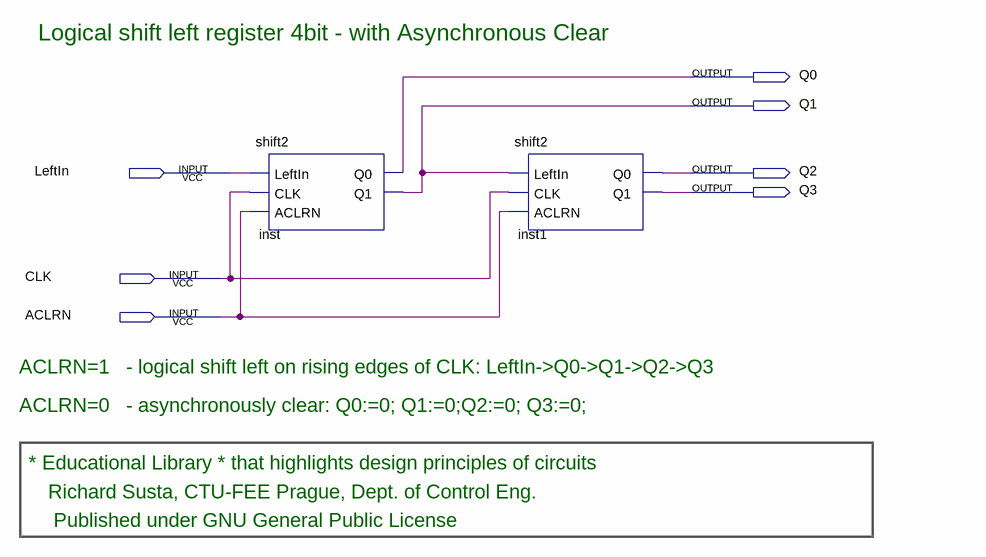
[diagram p0: schematic sheet]
// Quartus schematic shift4.bdf as structural Verilog: 2 symbols, 7 pins
module shift4 (
  input  LeftIn,
  input  CLK,
  input  ACLRN,
  output Q0,
  output Q1,
  output Q2,
  output Q3
);

  shift2 inst (.LeftIn(LeftIn), .CLK(CLK), .ACLRN(ACLRN), .Q0(Q0), .Q1(Q1));
  shift2 inst1 (.LeftIn(Q1), .CLK(CLK), .ACLRN(ACLRN), .Q0(Q2), .Q1(Q3));

  // Notes on the sheet:
  //   Logical shift left register 4bit - with Asynchronous Clear
  //   ACLRN=1   - logical shift left on rising edges of CLK: LeftIn->Q0->Q1->Q2->Q3
  //   ACLRN=0   - asynchronously clear: Q0:=0; Q1:=0;Q2:=0; Q3:=0;
  //   * Educational Library * that highlights design principles of circuits
  //   Richard Susta, CTU-FEE Prague, Dept. of Control Eng. 
  //    Published under GNU General Public License
endmodule
